# Altium project Self_balancing_bot.PrjPcb
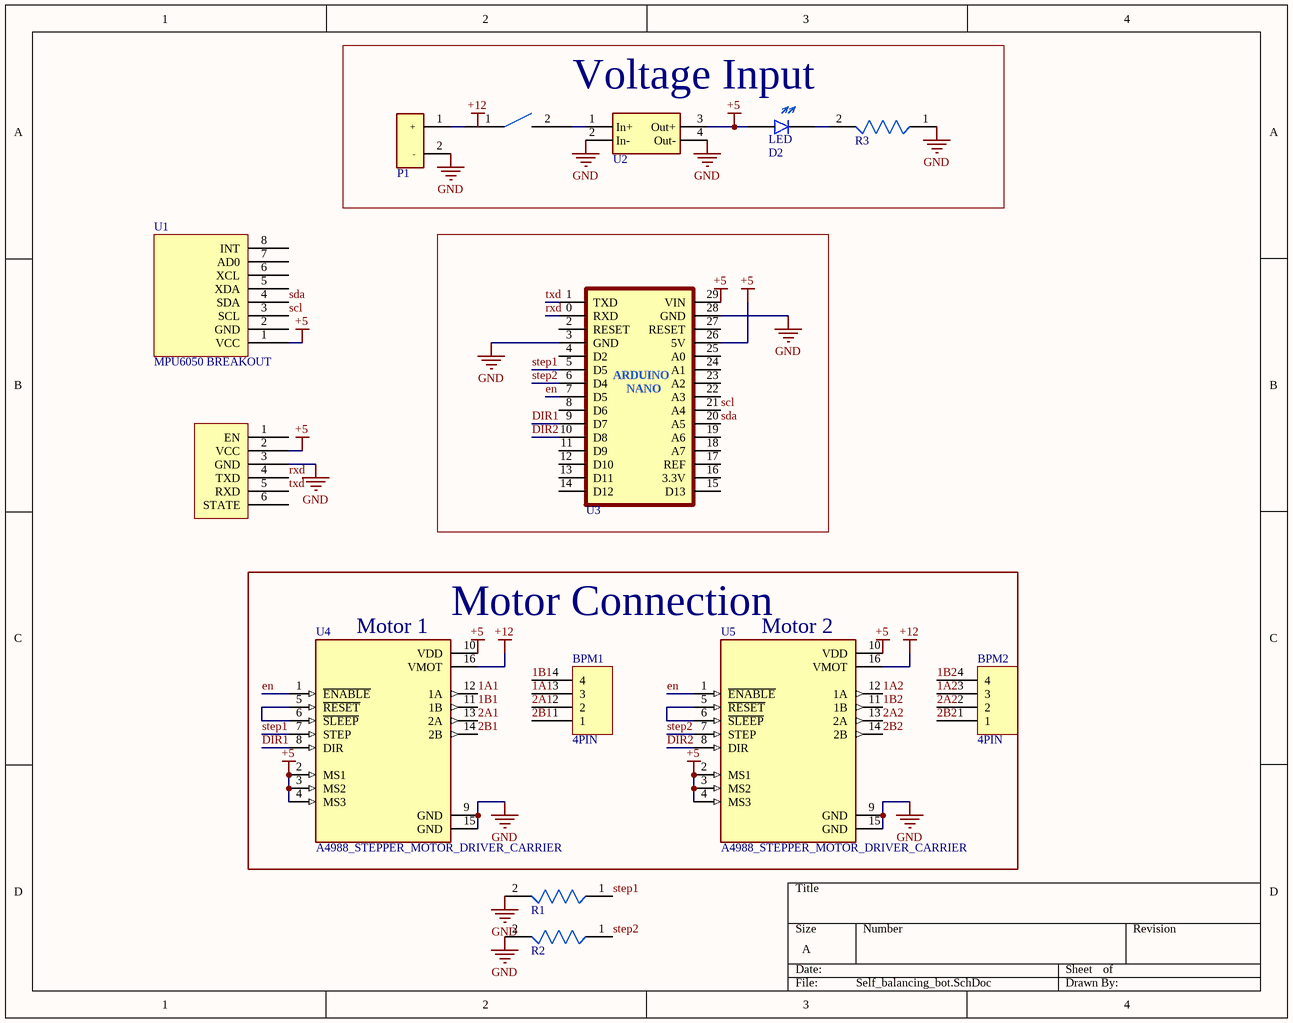
[diagram p0: Self_balancing_bot.SchDoc]
1 sheet, 14 parts. Net scope: global (net labels, ports and power ports of the same name join across sheets).
Board file: Self_balancing_bot.PcbDoc

## Sheet Self_balancing_bot.SchDoc
size A; SheetNumber: 1; SheetTotal: 1

### Parts
*  Switch  [Switch]  (value not drawn)
?  hc-05 development  [hc-05 - duplicate]  (value not drawn)
BPM1  4PIN  [4pin]
BPM2  4PIN  [4pin]
D2  self  [LED (RED)]  (value not drawn)
P1  HEADER, 2 PINS  [XT60 Male]  (value not drawn)
R1  Resistor  [Resistor]  (value not drawn)
R2  Resistor  [Resistor]  (value not drawn)
R3  Resistor  [Resistor]  (value not drawn)
U1  MPU6050 BREAKOUT  [MPU6050 BREAKOUT]
U2  LM2596  [LM2596]  (value not drawn)
U3  Arduino Nano  [Arduino Nano]  (value not drawn)
U4  A4988_STEPPER_MOTOR_DRIVER_CARRIER  [MODULE_A4988_STEPPER_MOTOR_DRIVER_CARRIER]
U5  A4988_STEPPER_MOTOR_DRIVER_CARRIER  [MODULE_A4988_STEPPER_MOTOR_DRIVER_CARRIER]

### Blocks framed on the sheet
Voltage Input: * D2 P1 R3 U2
Motor Connection: BPM1 BPM2 U4 U5

### Nets
+5: ?.2(VCC) D2.1 U1.1(VCC) U2.3(Out+) U3.26(5V) U3.29(VIN) U4.2(MS1) U4.3(MS2) U4.4(MS3) U4.10(VDD) U5.2(MS1) U5.3(MS2) U5.4(MS3) U5.10(VDD)
+12: U4.16(VMOT) U5.16(VMOT)
GND: ?.3(GND) P1.2(-) R1.2 R2.2 R3.1 U2.2(In-) U2.4(Out-) U3.3(GND) U3.28(GND) U4.9(GND) U4.15(GND) U5.9(GND) U5.15(GND)
1A1: BPM1.3 U4.12(1A)
1A2: BPM2.3 U5.12(1A)
1B1: BPM1.4 U4.11(1B)
1B2: BPM2.4 U5.11(1B)
2A1: BPM1.2 U4.13(2A)
2A2: BPM2.2 U5.13(2A)
2B1: BPM1.1 U4.14(2B)
2B2: BPM2.1 U5.14(2B)
DIR1: U3.9(D7) U4.8(DIR)
DIR2: U3.10(D8) U5.8(DIR)
en: U3.7(D5) U4.1(~{ENABLE}) U5.1(~{ENABLE})
rxd: ?.4(TXD) U3.0(RXD)
scl: U1.3(SCL) U3.21(A4)
sda: U1.4(SDA) U3.20(A5)
step1: R1.1 U3.5(D5) U4.7(STEP)
step2: R2.1 U3.6(D4) U5.7(STEP)
txd: ?.5(RXD) U3.1(TXD)
Net*_1: *.1 P1.1(+)
Net*_2: *.2 U2.1(In+)
NetD2_2: D2.2 R3.2
NetU4_5: U4.5(~{RESET}) U4.6(~{SLEEP})
NetU5_5: U5.5(~{RESET}) U5.6(~{SLEEP})

Not connected (* = marked no-connect by the designer): ? 1(EN) 6(STATE); U1 2(GND) 5(XDA) 6(XCL) 7(AD0) 8(INT); U3 2(RESET) 4(D2) 8(D6) 11(D9) 12(D10) 13(D11) 14(D12) 15(D13) 16(3.3V) 17(REF) 18(A7) 19(A6) 22(A3) 23(A2) 24(A1) 25(A0) 27(RESET)

### Notes on the sheet
- (near U4) Motor 1
- (near U5) Motor 2
- Labels drawn without touching a wire or pin: +12
- (in symbol Arduino Nano) ARDUINO; NANO
- (in symbol LED (Red)) LED

### Library data of the parts
* = Switch: Rocker Switch
BPM1 BPM2 = JST 4 pin: CONNECTOR"
D2 = LED (Red): Red
P1 = XT60 MALE: CONNECTOR
U1 = MPU6050 BREAKOUT: 8 pin, 2.54mm pitch
U2 = LM2596: DC-DC BUCK CONVERTER, MAX 3 AMP, OUTPUT 1.25-35 V
U3 = Arduino Nano: Development Board
U4 U5 = A4988_STEPPER_MOTOR_DRIVER_CARRIER: Stepper motor controler; IC: A4988; 1A; Uin mot: 8Ã·35V; Price: None; Value: *; MP: A4988_STEPPER_MOTOR_DRIVER_CARRIER; Package: None; Availability: Unavailable